# Altium schematic sheet led.SchDoc
size A4; DocumentNumber: 4; SheetNumber: 4; SheetTotal: 4
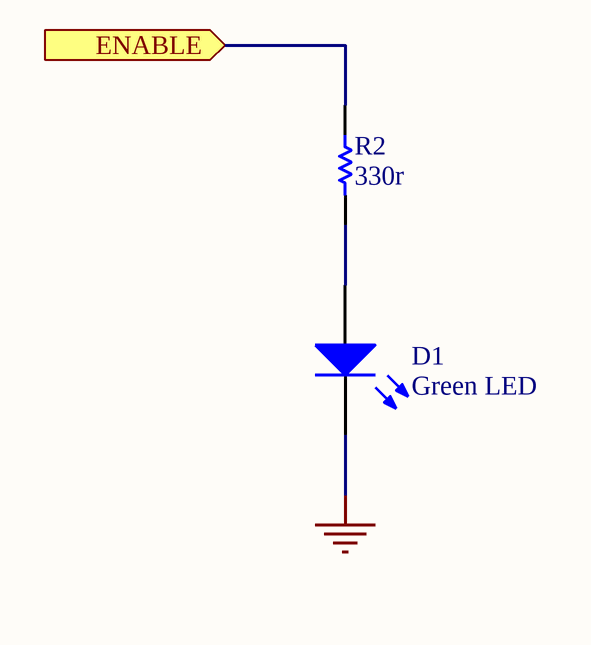
[diagram p0: led.SchDoc]

## Parts
D1  Green LED  [LED 0805]
R2  330r  [RESC1608N]

## Ports
ENABLE (in)

## Nets
GND: D1.2(K)
ENABLE: R2.1 ; port ENABLE
NetD1_1: D1.1(A) R2.2

## Library data of the parts
D1 = LED0: Typical INFRARED GaAs LED; Fournisseur: Farnell; Published: 8-Jun-2000; LatestRevisionDate: 08-Jul-2005; LatestRevisionNote: Mech Layer 1 removed.; PackageReference: LED-0; Publisher: Altium Limited; PackageDescription: LED; 2 Leads
R2 = Res1: Resistor; Fournisseur: Farnell; Published: 8-Jun-2000; LatestRevisionDate: 17-Jul-2002; LatestRevisionNote: Re-released for DXP Platform.; PackageReference: AXIAL-0.3; Publisher: Altium Limited; PackageDescription: Axial Device, Thru-Hole; 2 Leads; 0.3 in Pin Spacing; Value: 330r